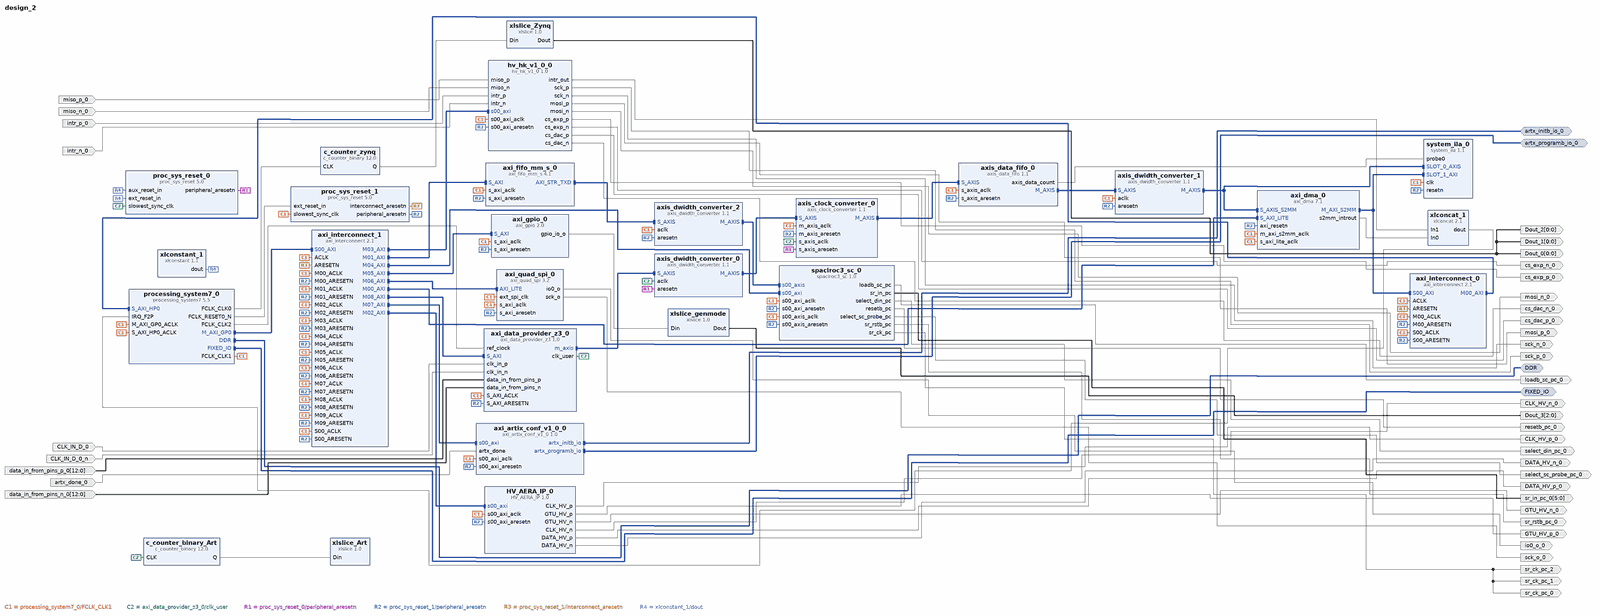
[diagram p0: block diagram of the top level, whole]
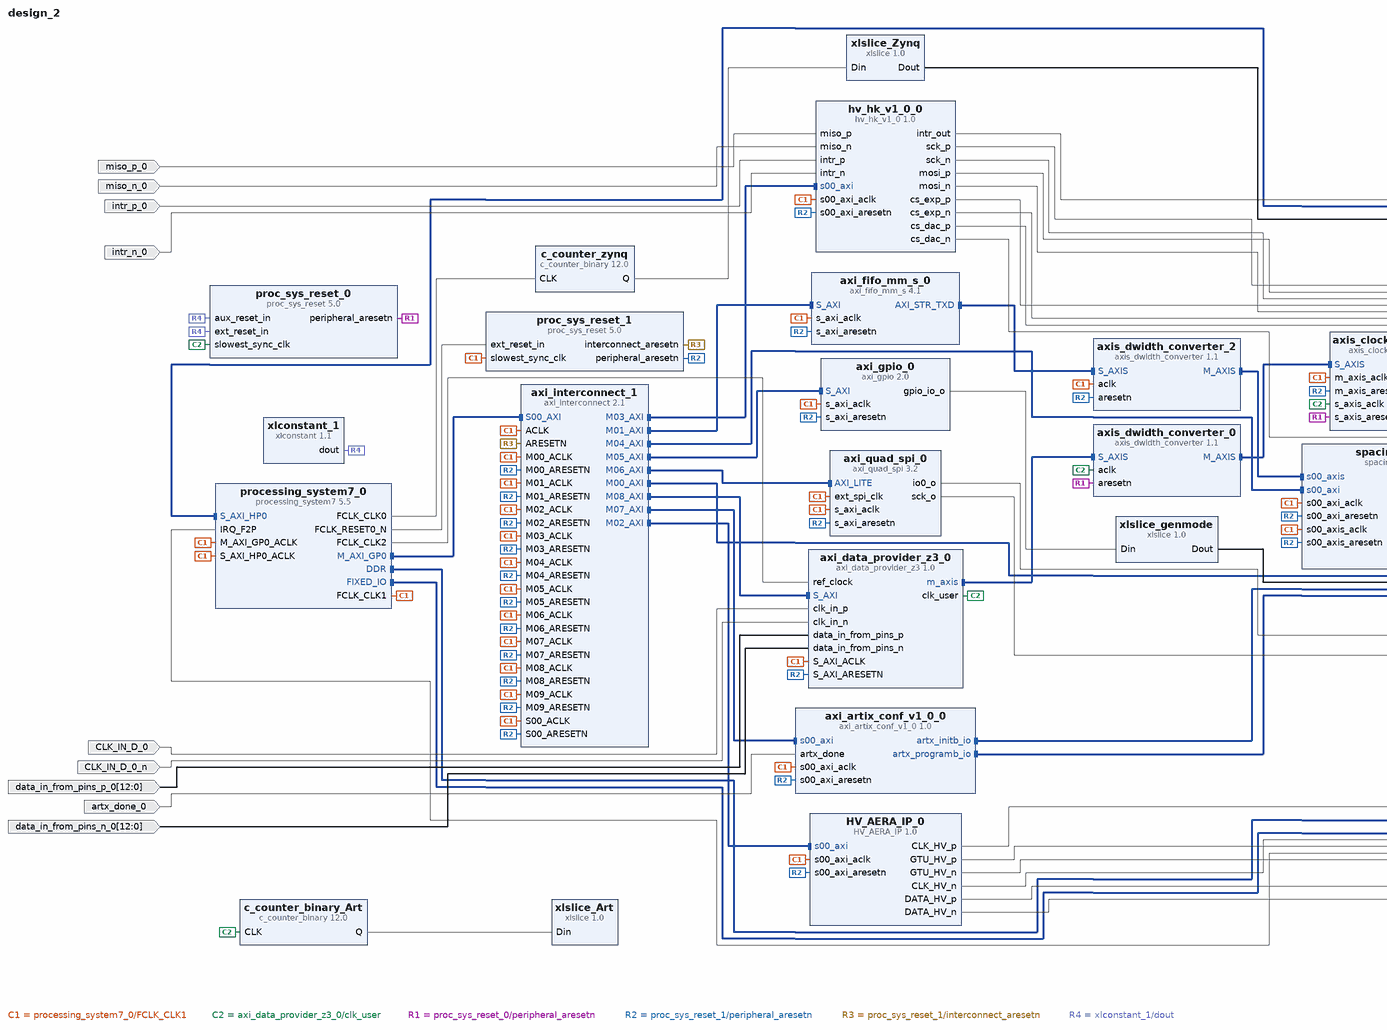
[diagram p1: block diagram of the top level, left part]
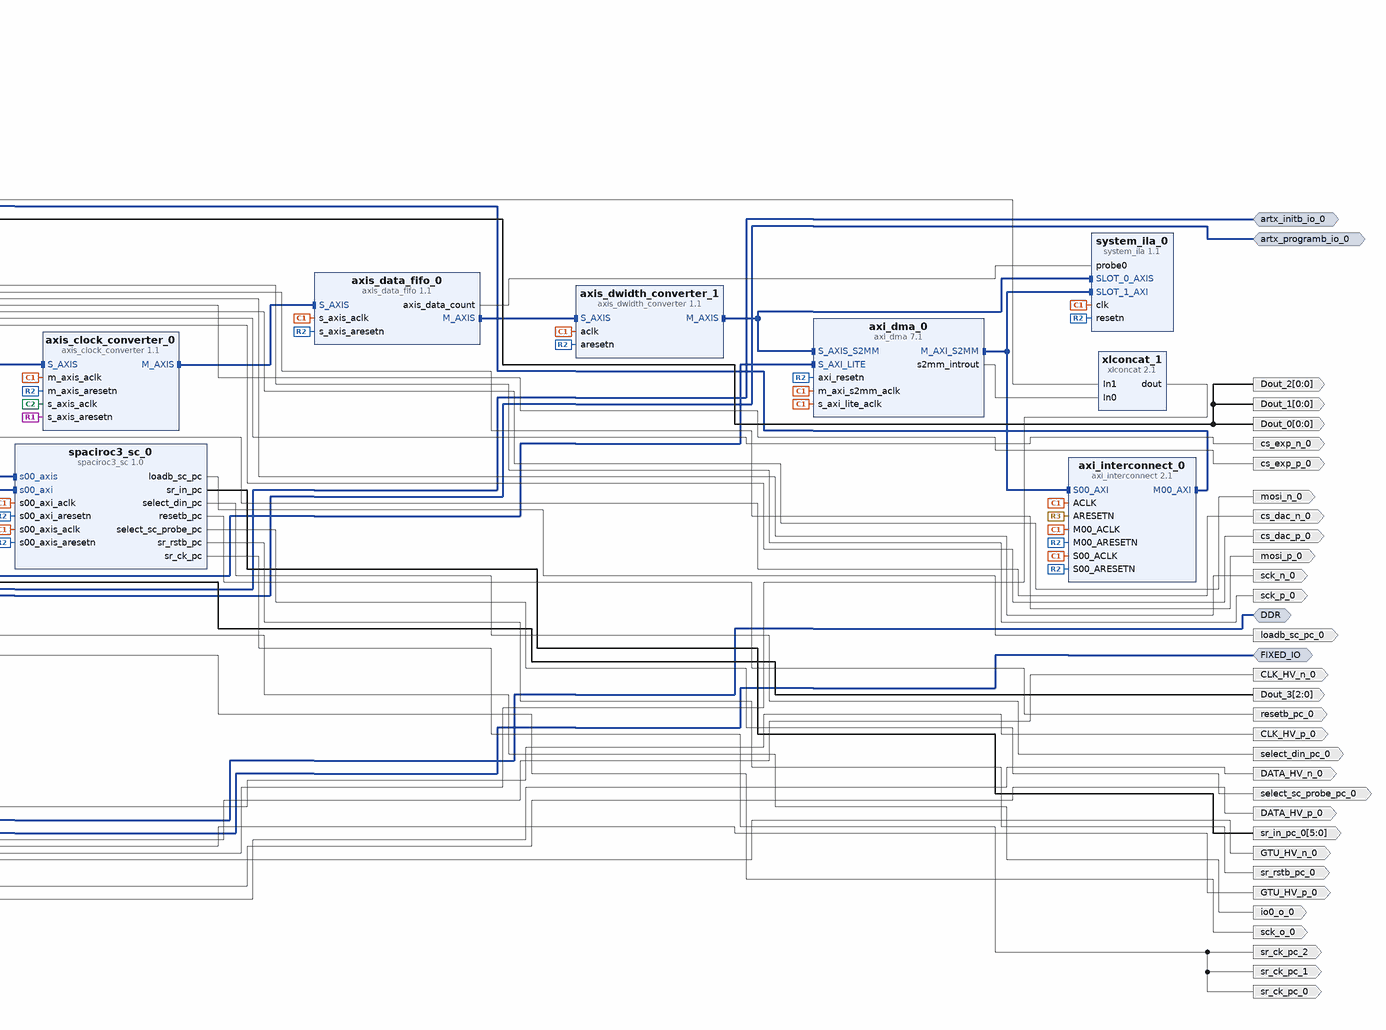
[diagram p2: block diagram of the top level, right part]
# Vivado block design design_2, xc7z035ffg676-2, Vivado 2018.1
create_bd_design design_2

create_bd_intf_port -mode Master -vlnv xilinx.com:interface:ddrx_rtl:1.0 DDR
create_bd_intf_port -mode Master -vlnv xilinx.com:display_processing_system7:fixedio_rtl:1.0 FIXED_IO
create_bd_intf_port -mode Master -vlnv xilinx.com:interface:gpio_rtl:1.0 artx_initb_io_0
create_bd_intf_port -mode Master -vlnv xilinx.com:interface:gpio_rtl:1.0 artx_programb_io_0
create_bd_intf_port -mode Slave -vlnv xilinx.com:interface:diff_clock_rtl:1.0 CLK_IN_D_0
create_bd_port -dir O -from 0 -to 0 Dout_2
create_bd_port -dir O -from 0 -to 0 Dout_1
create_bd_port -dir O -from 0 -to 0 Dout_0
create_bd_port -dir O sck_p_0
create_bd_port -dir O sck_n_0
create_bd_port -dir O mosi_p_0
create_bd_port -dir O mosi_n_0
create_bd_port -dir O cs_exp_p_0
create_bd_port -dir O cs_exp_n_0
create_bd_port -dir O cs_dac_p_0
create_bd_port -dir O cs_dac_n_0
create_bd_port -dir I miso_p_0
create_bd_port -dir I miso_n_0
create_bd_port -dir I intr_p_0
create_bd_port -dir I intr_n_0
create_bd_port -dir O -from 5 -to 0 sr_in_pc_0
create_bd_port -dir O loadb_sc_pc_0
create_bd_port -dir O select_din_pc_0
create_bd_port -dir O resetb_pc_0
create_bd_port -dir O select_sc_probe_pc_0
create_bd_port -dir O sr_rstb_pc_0
create_bd_port -dir O sr_ck_pc_1
create_bd_port -dir O sr_ck_pc_2
create_bd_port -dir O sr_ck_pc_0
create_bd_port -dir O GTU_HV_p_0
create_bd_port -dir O GTU_HV_n_0
create_bd_port -dir O CLK_HV_p_0
create_bd_port -dir O CLK_HV_n_0
create_bd_port -dir O DATA_HV_p_0
create_bd_port -dir O DATA_HV_n_0
create_bd_port -dir O -from 2 -to 0 Dout_3
create_bd_port -dir O io0_o_0
create_bd_port -dir O sck_o_0
create_bd_port -dir I artx_done_0
create_bd_port -dir I CLK_IN_D_0
create_bd_port -dir I CLK_IN_D_0_n
create_bd_port -dir I -from 12 -to 0 data_in_from_pins_p_0
create_bd_port -dir I -from 12 -to 0 data_in_from_pins_n_0

create_bd_cell -type ip -vlnv xilinx.com:ip:processing_system7:5.5 processing_system7_0
set_property -dict [list \
  CONFIG.PCW_FCLK_CLK1_BUF TRUE \
  CONFIG.PCW_FCLK_CLK2_BUF TRUE \
  CONFIG.PCW_UIPARAM_DDR_FREQ_MHZ 533.333333 \
  CONFIG.PCW_CPU_CPU_6X4X_MAX_RANGE 800 \
  CONFIG.PCW_APU_PERIPHERAL_FREQMHZ 800 \
  CONFIG.PCW_SDIO_PERIPHERAL_FREQMHZ 100 \
  CONFIG.PCW_UART_PERIPHERAL_FREQMHZ 100 \
  CONFIG.PCW_FPGA0_PERIPHERAL_FREQMHZ 200 \
  CONFIG.PCW_FPGA1_PERIPHERAL_FREQMHZ 100 \
  CONFIG.PCW_FPGA2_PERIPHERAL_FREQMHZ 200 \
  CONFIG.PCW_USE_S_AXI_HP0 1 \
  CONFIG.PCW_USE_FABRIC_INTERRUPT 1 \
  CONFIG.PCW_EN_CLK1_PORT 1 \
  CONFIG.PCW_EN_CLK2_PORT 1 \
  CONFIG.PCW_IRQ_F2P_INTR 1 \
  CONFIG.PCW_GP0_EN_MODIFIABLE_TXN 0 \
  CONFIG.PCW_GP1_EN_MODIFIABLE_TXN 0 \
  CONFIG.PCW_PERIPHERAL_BOARD_PRESET None \
  CONFIG.PCW_PRESET_BANK0_VOLTAGE {LVCMOS 1.8V} \
  CONFIG.PCW_PRESET_BANK1_VOLTAGE {LVCMOS 1.8V} \
  CONFIG.PCW_UIPARAM_DDR_PARTNO {MT41K256M16 RE-15E} \
  CONFIG.PCW_QSPI_PERIPHERAL_ENABLE 1 \
  CONFIG.PCW_QSPI_QSPI_IO {MIO 1 .. 6} \
  CONFIG.PCW_QSPI_GRP_SINGLE_SS_ENABLE 1 \
  CONFIG.PCW_QSPI_GRP_SINGLE_SS_IO {MIO 1 .. 6} \
  CONFIG.PCW_SINGLE_QSPI_DATA_MODE x4 \
  CONFIG.PCW_ENET0_PERIPHERAL_ENABLE 1 \
  CONFIG.PCW_ENET0_ENET0_IO {MIO 16 .. 27} \
  CONFIG.PCW_ENET0_GRP_MDIO_ENABLE 1 \
  CONFIG.PCW_ENET0_GRP_MDIO_IO {MIO 52 .. 53} \
  CONFIG.PCW_SD0_PERIPHERAL_ENABLE 1 \
  CONFIG.PCW_SD0_SD0_IO {MIO 40 .. 45} \
  CONFIG.PCW_SD0_GRP_CD_ENABLE 0 \
  CONFIG.PCW_SD0_GRP_WP_ENABLE 0 \
  CONFIG.PCW_SD1_PERIPHERAL_ENABLE 1 \
  CONFIG.PCW_SD1_SD1_IO {MIO 10 .. 15} \
  CONFIG.PCW_UART0_PERIPHERAL_ENABLE 1 \
  CONFIG.PCW_UART0_UART0_IO {MIO 50 .. 51} \
  CONFIG.PCW_UART1_PERIPHERAL_ENABLE 1 \
  CONFIG.PCW_UART1_UART1_IO {MIO 48 .. 49} \
  CONFIG.PCW_USB0_PERIPHERAL_ENABLE 1 \
  CONFIG.PCW_USB0_USB0_IO {MIO 28 .. 39} \
  CONFIG.PCW_GPIO_MIO_GPIO_ENABLE 0 \
  CONFIG.PCW_FPGA_FCLK1_ENABLE 1 \
  CONFIG.PCW_FPGA_FCLK2_ENABLE 1 \
] [get_bd_cells processing_system7_0]
# 494 more settings of processing_system7_0 are not shown: defaults, MIO pin electricals, DDR timing, and values the tool derives
create_bd_cell -type ip -vlnv xilinx.com:ip:c_counter_binary:12.0 c_counter_zynq
create_bd_cell -type ip -vlnv xilinx.com:ip:xlslice:1.0 xlslice_Zynq
set_property -dict {CONFIG.DIN_TO 0 CONFIG.DIN_FROM 0 CONFIG.DIN_WIDTH 16} [get_bd_cells xlslice_Zynq]
create_bd_cell -type ip -vlnv xilinx.com:ip:axis_dwidth_converter:1.1 axis_dwidth_converter_0
set_property -dict {CONFIG.M_TDATA_NUM_BYTES 1 CONFIG.HAS_TLAST 1 CONFIG.HAS_MI_TKEEP 0} [get_bd_cells axis_dwidth_converter_0]
create_bd_cell -type ip -vlnv xilinx.com:ip:axis_data_fifo:1.1 axis_data_fifo_0
set_property -dict {CONFIG.FIFO_DEPTH 4096 CONFIG.FIFO_MODE 2} [get_bd_cells axis_data_fifo_0]
create_bd_cell -type ip -vlnv xilinx.com:ip:axis_clock_converter:1.1 axis_clock_converter_0
create_bd_cell -type ip -vlnv xilinx.com:ip:proc_sys_reset:5.0 proc_sys_reset_1
create_bd_cell -type ip -vlnv xilinx.com:ip:axi_dma:7.1 axi_dma_0
set_property -dict [list \
  CONFIG.c_include_sg 0 \
  CONFIG.c_sg_length_width 16 \
  CONFIG.c_include_mm2s 0 \
  CONFIG.c_include_s2mm 1 \
] [get_bd_cells axi_dma_0]
create_bd_cell -type ip -vlnv xilinx.com:ip:axi_interconnect:2.1 axi_interconnect_0
set_property -dict {CONFIG.NUM_MI 1} [get_bd_cells axi_interconnect_0]
create_bd_cell -type ip -vlnv xilinx.com:ip:axi_interconnect:2.1 axi_interconnect_1
set_property -dict {CONFIG.NUM_MI 10} [get_bd_cells axi_interconnect_1]
create_bd_cell -type ip -vlnv xilinx.com:ip:axis_dwidth_converter:1.1 axis_dwidth_converter_1
set_property -dict {CONFIG.M_TDATA_NUM_BYTES 8} [get_bd_cells axis_dwidth_converter_1]
create_bd_cell -type ip -vlnv xilinx.com:ip:xlconstant:1.1 xlconstant_1
create_bd_cell -type ip -vlnv xilinx.com:ip:proc_sys_reset:5.0 proc_sys_reset_0
create_bd_cell -type ip -vlnv xilinx.com:ip:c_counter_binary:12.0 c_counter_binary_Art
create_bd_cell -type ip -vlnv xilinx.com:ip:xlslice:1.0 xlslice_Art
set_property -dict {CONFIG.DIN_TO 4 CONFIG.DIN_FROM 4 CONFIG.DIN_WIDTH 16 CONFIG.DOUT_WIDTH 1} [get_bd_cells xlslice_Art]
create_bd_cell -type ip -vlnv xilinx.com:ip:system_ila:1.1 system_ila_0
set_property -dict [list \
  CONFIG.C_SLOT 0 \
  CONFIG.C_SLOT_0_APC_EN 0 \
  CONFIG.C_SLOT_1_APC_EN 0 \
  CONFIG.C_SLOT_1_AXI_AW_SEL_DATA 1 \
  CONFIG.C_SLOT_1_AXI_W_SEL_DATA 1 \
  CONFIG.C_SLOT_1_AXI_B_SEL_DATA 1 \
  CONFIG.C_SLOT_1_AXI_AR_SEL_DATA 1 \
  CONFIG.C_SLOT_1_AXI_R_SEL_DATA 1 \
  CONFIG.C_SLOT_1_AXI_AW_SEL_TRIG 1 \
  CONFIG.C_SLOT_1_AXI_W_SEL_TRIG 1 \
  CONFIG.C_SLOT_1_AXI_B_SEL_TRIG 1 \
  CONFIG.C_SLOT_1_AXI_AR_SEL_TRIG 1 \
  CONFIG.C_SLOT_1_AXI_R_SEL_TRIG 1 \
  CONFIG.C_SLOT_0_AXI_DATA_SEL 1 \
  CONFIG.C_SLOT_0_AXI_TRIG_SEL 1 \
  CONFIG.C_PROBE0_TYPE 0 \
  CONFIG.C_NUM_OF_PROBES 1 \
  CONFIG.C_NUM_MONITOR_SLOTS 2 \
  CONFIG.C_SLOT_0_INTF_TYPE xilinx.com:interface:axis_rtl:1.0 \
  CONFIG.C_SLOT_1_INTF_TYPE xilinx.com:interface:aximm_rtl:1.0 \
  CONFIG.C_MON_TYPE MIX \
] [get_bd_cells system_ila_0]
create_bd_cell -type ip -vlnv user.org:user:HV_AERA_IP:1.0 HV_AERA_IP_0
create_bd_cell -type ip -vlnv user.org:user:hv_hk_v1_0:1.0 hv_hk_v1_0_0
create_bd_cell -type ip -vlnv user.org:user:spaciroc3_sc:1.0 spaciroc3_sc_0
create_bd_cell -type ip -vlnv xilinx.com:ip:axis_dwidth_converter:1.1 axis_dwidth_converter_2
set_property -dict {CONFIG.S_TDATA_NUM_BYTES 4 CONFIG.M_TDATA_NUM_BYTES 24} [get_bd_cells axis_dwidth_converter_2]
create_bd_cell -type ip -vlnv xilinx.com:ip:axi_fifo_mm_s:4.1 axi_fifo_mm_s_0
set_property -dict [list \
  CONFIG.C_TX_FIFO_PE_THRESHOLD 2 \
  CONFIG.C_TX_FIFO_PF_THRESHOLD 4091 \
  CONFIG.C_TX_FIFO_DEPTH 4096 \
  CONFIG.C_USE_TX_DATA 1 \
  CONFIG.C_USE_RX_DATA 0 \
  CONFIG.C_USE_TX_CTRL 0 \
] [get_bd_cells axi_fifo_mm_s_0]
create_bd_cell -type ip -vlnv xilinx.com:ip:xlconcat:2.1 xlconcat_1
create_bd_cell -type ip -vlnv xilinx.com:ip:axi_gpio:2.0 axi_gpio_0
set_property -dict {CONFIG.C_ALL_OUTPUTS 1} [get_bd_cells axi_gpio_0]
create_bd_cell -type ip -vlnv xilinx.com:ip:xlslice:1.0 xlslice_genmode
set_property -dict {CONFIG.DIN_FROM 2 CONFIG.DOUT_WIDTH 3} [get_bd_cells xlslice_genmode]
create_bd_cell -type ip -vlnv xilinx.com:ip:axi_quad_spi:3.2 axi_quad_spi_0
set_property -dict {CONFIG.C_USE_STARTUP 0 CONFIG.C_FIFO_DEPTH 256} [get_bd_cells axi_quad_spi_0]
create_bd_cell -type ip -vlnv xilinx.com:user:axi_artix_conf_v1_0:1.0 axi_artix_conf_v1_0_0
create_bd_cell -type ip -vlnv user.org:user:axi_data_provider_z3:1.0 axi_data_provider_z3_0

# ---- connections ----

connect_bd_intf_net [get_bd_intf_pins axis_dwidth_converter_0/M_AXIS] [get_bd_intf_pins axis_clock_converter_0/S_AXIS]
connect_bd_intf_net [get_bd_intf_pins axis_clock_converter_0/M_AXIS] [get_bd_intf_pins axis_data_fifo_0/S_AXIS]
connect_bd_intf_net [get_bd_intf_pins axi_interconnect_0/M00_AXI] [get_bd_intf_pins processing_system7_0/S_AXI_HP0]
connect_bd_intf_net [get_bd_intf_pins axi_interconnect_1/S00_AXI] [get_bd_intf_pins processing_system7_0/M_AXI_GP0]
connect_bd_intf_net [get_bd_intf_pins axi_interconnect_1/M00_AXI] [get_bd_intf_pins axi_dma_0/S_AXI_LITE]
connect_bd_intf_net [get_bd_intf_pins axis_data_fifo_0/M_AXIS] [get_bd_intf_pins axis_dwidth_converter_1/S_AXIS]
connect_bd_intf_net [get_bd_intf_pins axis_dwidth_converter_1/M_AXIS] [get_bd_intf_pins axi_dma_0/S_AXIS_S2MM]
connect_bd_intf_net [get_bd_intf_pins axis_dwidth_converter_1/M_AXIS] [get_bd_intf_pins system_ila_0/SLOT_0_AXIS]
connect_bd_intf_net [get_bd_intf_pins axi_interconnect_0/S00_AXI] [get_bd_intf_pins axi_dma_0/M_AXI_S2MM]
connect_bd_intf_net [get_bd_intf_pins axi_interconnect_0/S00_AXI] [get_bd_intf_pins system_ila_0/SLOT_1_AXI]
connect_bd_intf_net [get_bd_intf_pins axi_fifo_mm_s_0/AXI_STR_TXD] [get_bd_intf_pins axis_dwidth_converter_2/S_AXIS]
connect_bd_intf_net [get_bd_intf_pins axis_dwidth_converter_2/M_AXIS] [get_bd_intf_pins spaciroc3_sc_0/s00_axis]
connect_bd_intf_net [get_bd_intf_pins axi_interconnect_1/M01_AXI] [get_bd_intf_pins axi_fifo_mm_s_0/S_AXI]
connect_bd_intf_net [get_bd_intf_pins axi_interconnect_1/M02_AXI] [get_bd_intf_pins HV_AERA_IP_0/s00_axi]
connect_bd_intf_net [get_bd_intf_pins axi_interconnect_1/M03_AXI] [get_bd_intf_pins hv_hk_v1_0_0/s00_axi]
connect_bd_intf_net [get_bd_intf_pins spaciroc3_sc_0/s00_axi] [get_bd_intf_pins axi_interconnect_1/M04_AXI]
connect_bd_intf_net [get_bd_intf_pins axi_interconnect_1/M05_AXI] [get_bd_intf_pins axi_gpio_0/S_AXI]
connect_bd_intf_net [get_bd_intf_pins axi_interconnect_1/M06_AXI] [get_bd_intf_pins axi_quad_spi_0/AXI_LITE]
connect_bd_intf_net [get_bd_intf_pins axi_interconnect_1/M07_AXI] [get_bd_intf_pins axi_artix_conf_v1_0_0/s00_axi]
connect_bd_intf_net [get_bd_intf_pins axi_data_provider_z3_0/S_AXI] [get_bd_intf_pins axi_interconnect_1/M08_AXI]
connect_bd_intf_net [get_bd_intf_pins axis_dwidth_converter_0/S_AXIS] [get_bd_intf_pins axi_data_provider_z3_0/m_axis]
connect_bd_intf_net [get_bd_intf_ports DDR] [get_bd_intf_pins processing_system7_0/DDR]
connect_bd_intf_net [get_bd_intf_ports FIXED_IO] [get_bd_intf_pins processing_system7_0/FIXED_IO]
connect_bd_intf_net [get_bd_intf_ports artx_initb_io_0] [get_bd_intf_pins axi_artix_conf_v1_0_0/artx_initb_io]
connect_bd_intf_net [get_bd_intf_ports artx_programb_io_0] [get_bd_intf_pins axi_artix_conf_v1_0_0/artx_programb_io]
connect_bd_net [get_bd_pins processing_system7_0/FCLK_CLK0] [get_bd_pins c_counter_zynq/CLK]
connect_bd_net -net c_counter_binary_0_Q [get_bd_pins c_counter_zynq/Q] [get_bd_pins xlslice_Zynq/Din]
connect_bd_net [get_bd_pins xlslice_Zynq/Dout] [get_bd_ports Dout_0] [get_bd_ports Dout_1] [get_bd_ports Dout_2]
connect_bd_net [get_bd_pins processing_system7_0/FCLK_CLK1] \
  [get_bd_pins axis_data_fifo_0/s_axis_aclk] [get_bd_pins proc_sys_reset_1/slowest_sync_clk] \
  [get_bd_pins axis_clock_converter_0/m_axis_aclk] [get_bd_pins axi_dma_0/s_axi_lite_aclk] \
  [get_bd_pins axi_dma_0/m_axi_s2mm_aclk] [get_bd_pins processing_system7_0/M_AXI_GP0_ACLK] \
  [get_bd_pins processing_system7_0/S_AXI_HP0_ACLK] [get_bd_pins axis_dwidth_converter_1/aclk] [get_bd_pins system_ila_0/clk] \
  [get_bd_pins HV_AERA_IP_0/s00_axi_aclk] [get_bd_pins spaciroc3_sc_0/s00_axi_aclk] \
  [get_bd_pins spaciroc3_sc_0/s00_axis_aclk] [get_bd_pins hv_hk_v1_0_0/s00_axi_aclk] \
  [get_bd_pins axis_dwidth_converter_2/aclk] [get_bd_pins axi_fifo_mm_s_0/s_axi_aclk] [get_bd_pins axi_gpio_0/s_axi_aclk] \
  [get_bd_pins axi_quad_spi_0/s_axi_aclk] [get_bd_pins axi_artix_conf_v1_0_0/s00_axi_aclk] \
  [get_bd_pins axi_quad_spi_0/ext_spi_clk] [get_bd_pins axi_data_provider_z3_0/S_AXI_ACLK] \
  [get_bd_pins axi_interconnect_0/ACLK] [get_bd_pins axi_interconnect_0/S00_ACLK] [get_bd_pins axi_interconnect_0/M00_ACLK] \
  [get_bd_pins axi_interconnect_1/ACLK] [get_bd_pins axi_interconnect_1/S00_ACLK] [get_bd_pins axi_interconnect_1/M00_ACLK] \
  [get_bd_pins axi_interconnect_1/M01_ACLK] [get_bd_pins axi_interconnect_1/M02_ACLK] \
  [get_bd_pins axi_interconnect_1/M03_ACLK] [get_bd_pins axi_interconnect_1/M04_ACLK] \
  [get_bd_pins axi_interconnect_1/M05_ACLK] [get_bd_pins axi_interconnect_1/M06_ACLK] \
  [get_bd_pins axi_interconnect_1/M07_ACLK] [get_bd_pins axi_interconnect_1/M08_ACLK] \
  [get_bd_pins axi_interconnect_1/M09_ACLK]
connect_bd_net -net util_ds_buf_0_BUFG_O [get_bd_pins axi_data_provider_z3_0/clk_user] \
  [get_bd_pins axis_dwidth_converter_0/aclk] [get_bd_pins axis_clock_converter_0/s_axis_aclk] \
  [get_bd_pins proc_sys_reset_0/slowest_sync_clk] [get_bd_pins c_counter_binary_Art/CLK]
connect_bd_net [get_bd_pins proc_sys_reset_0/peripheral_aresetn] \
  [get_bd_pins axis_dwidth_converter_0/aresetn] [get_bd_pins axis_clock_converter_0/s_axis_aresetn]
connect_bd_net [get_bd_pins processing_system7_0/FCLK_RESET0_N] [get_bd_pins proc_sys_reset_1/ext_reset_in]
connect_bd_net [get_bd_pins proc_sys_reset_1/peripheral_aresetn] \
  [get_bd_pins axis_data_fifo_0/s_axis_aresetn] [get_bd_pins axis_clock_converter_0/m_axis_aresetn] \
  [get_bd_pins axi_dma_0/axi_resetn] [get_bd_pins axis_dwidth_converter_1/aresetn] [get_bd_pins system_ila_0/resetn] \
  [get_bd_pins HV_AERA_IP_0/s00_axi_aresetn] [get_bd_pins spaciroc3_sc_0/s00_axi_aresetn] \
  [get_bd_pins spaciroc3_sc_0/s00_axis_aresetn] [get_bd_pins hv_hk_v1_0_0/s00_axi_aresetn] \
  [get_bd_pins axis_dwidth_converter_2/aresetn] [get_bd_pins axi_fifo_mm_s_0/s_axi_aresetn] \
  [get_bd_pins axi_gpio_0/s_axi_aresetn] [get_bd_pins axi_quad_spi_0/s_axi_aresetn] \
  [get_bd_pins axi_artix_conf_v1_0_0/s00_axi_aresetn] [get_bd_pins axi_data_provider_z3_0/S_AXI_ARESETN] \
  [get_bd_pins axi_interconnect_0/S00_ARESETN] [get_bd_pins axi_interconnect_0/M00_ARESETN] \
  [get_bd_pins axi_interconnect_1/S00_ARESETN] [get_bd_pins axi_interconnect_1/M00_ARESETN] \
  [get_bd_pins axi_interconnect_1/M01_ARESETN] [get_bd_pins axi_interconnect_1/M02_ARESETN] \
  [get_bd_pins axi_interconnect_1/M03_ARESETN] [get_bd_pins axi_interconnect_1/M04_ARESETN] \
  [get_bd_pins axi_interconnect_1/M05_ARESETN] [get_bd_pins axi_interconnect_1/M06_ARESETN] \
  [get_bd_pins axi_interconnect_1/M07_ARESETN] [get_bd_pins axi_interconnect_1/M08_ARESETN] \
  [get_bd_pins axi_interconnect_1/M09_ARESETN]
connect_bd_net -net ARESETN_1 [get_bd_pins proc_sys_reset_1/interconnect_aresetn] \
  [get_bd_pins axi_interconnect_0/ARESETN] [get_bd_pins axi_interconnect_1/ARESETN]
connect_bd_net [get_bd_pins xlconstant_1/dout] [get_bd_pins proc_sys_reset_0/ext_reset_in] [get_bd_pins proc_sys_reset_0/aux_reset_in]
connect_bd_net [get_bd_pins c_counter_binary_Art/Q] [get_bd_pins xlslice_Art/Din]
connect_bd_net [get_bd_pins processing_system7_0/FCLK_CLK2] [get_bd_pins axi_data_provider_z3_0/ref_clock]
connect_bd_net [get_bd_pins axis_data_fifo_0/axis_data_count] [get_bd_pins system_ila_0/probe0]
connect_bd_net [get_bd_pins xlconcat_1/dout] [get_bd_pins processing_system7_0/IRQ_F2P]
connect_bd_net [get_bd_pins axi_dma_0/s2mm_introut] [get_bd_pins xlconcat_1/In0]
connect_bd_net [get_bd_pins hv_hk_v1_0_0/intr_out] [get_bd_pins xlconcat_1/In1]
connect_bd_net [get_bd_pins hv_hk_v1_0_0/sck_p] [get_bd_ports sck_p_0]
connect_bd_net [get_bd_pins hv_hk_v1_0_0/sck_n] [get_bd_ports sck_n_0]
connect_bd_net [get_bd_pins hv_hk_v1_0_0/mosi_p] [get_bd_ports mosi_p_0]
connect_bd_net [get_bd_pins hv_hk_v1_0_0/mosi_n] [get_bd_ports mosi_n_0]
connect_bd_net [get_bd_pins hv_hk_v1_0_0/cs_exp_p] [get_bd_ports cs_exp_p_0]
connect_bd_net [get_bd_pins hv_hk_v1_0_0/cs_exp_n] [get_bd_ports cs_exp_n_0]
connect_bd_net [get_bd_pins hv_hk_v1_0_0/cs_dac_p] [get_bd_ports cs_dac_p_0]
connect_bd_net [get_bd_pins hv_hk_v1_0_0/cs_dac_n] [get_bd_ports cs_dac_n_0]
connect_bd_net -net miso_p_0_1 [get_bd_ports miso_p_0] [get_bd_pins hv_hk_v1_0_0/miso_p]
connect_bd_net -net miso_n_0_1 [get_bd_ports miso_n_0] [get_bd_pins hv_hk_v1_0_0/miso_n]
connect_bd_net -net intr_p_0_1 [get_bd_ports intr_p_0] [get_bd_pins hv_hk_v1_0_0/intr_p]
connect_bd_net -net intr_n_0_1 [get_bd_ports intr_n_0] [get_bd_pins hv_hk_v1_0_0/intr_n]
connect_bd_net [get_bd_pins spaciroc3_sc_0/sr_in_pc] [get_bd_ports sr_in_pc_0]
connect_bd_net [get_bd_pins spaciroc3_sc_0/loadb_sc_pc] [get_bd_ports loadb_sc_pc_0]
connect_bd_net [get_bd_pins spaciroc3_sc_0/select_din_pc] [get_bd_ports select_din_pc_0]
connect_bd_net [get_bd_pins spaciroc3_sc_0/resetb_pc] [get_bd_ports resetb_pc_0]
connect_bd_net [get_bd_pins spaciroc3_sc_0/select_sc_probe_pc] [get_bd_ports select_sc_probe_pc_0]
connect_bd_net [get_bd_pins spaciroc3_sc_0/sr_rstb_pc] [get_bd_ports sr_rstb_pc_0]
connect_bd_net [get_bd_pins spaciroc3_sc_0/sr_ck_pc] [get_bd_ports sr_ck_pc_0] [get_bd_ports sr_ck_pc_2] [get_bd_ports sr_ck_pc_1]
connect_bd_net [get_bd_pins HV_AERA_IP_0/GTU_HV_p] [get_bd_ports GTU_HV_p_0]
connect_bd_net [get_bd_pins HV_AERA_IP_0/GTU_HV_n] [get_bd_ports GTU_HV_n_0]
connect_bd_net [get_bd_pins HV_AERA_IP_0/CLK_HV_p] [get_bd_ports CLK_HV_p_0]
connect_bd_net [get_bd_pins HV_AERA_IP_0/CLK_HV_n] [get_bd_ports CLK_HV_n_0]
connect_bd_net [get_bd_pins HV_AERA_IP_0/DATA_HV_p] [get_bd_ports DATA_HV_p_0]
connect_bd_net [get_bd_pins HV_AERA_IP_0/DATA_HV_n] [get_bd_ports DATA_HV_n_0]
connect_bd_net [get_bd_pins axi_gpio_0/gpio_io_o] [get_bd_pins xlslice_genmode/Din]
connect_bd_net -net xlslice_0_Dout [get_bd_pins xlslice_genmode/Dout] [get_bd_ports Dout_3]
connect_bd_net [get_bd_pins axi_quad_spi_0/io0_o] [get_bd_ports io0_o_0]
connect_bd_net [get_bd_pins axi_quad_spi_0/sck_o] [get_bd_ports sck_o_0]
connect_bd_net -net artx_done_0_1 [get_bd_ports artx_done_0] [get_bd_pins axi_artix_conf_v1_0_0/artx_done]
connect_bd_net -net clk_in_p_0_1 [get_bd_ports CLK_IN_D_0] [get_bd_pins axi_data_provider_z3_0/clk_in_p]
connect_bd_net -net clk_in_n_0_1 [get_bd_ports CLK_IN_D_0_n] [get_bd_pins axi_data_provider_z3_0/clk_in_n]
connect_bd_net -net data_in_from_pins_p_0_1 [get_bd_ports data_in_from_pins_p_0] [get_bd_pins axi_data_provider_z3_0/data_in_from_pins_p]
connect_bd_net -net data_in_from_pins_n_0_1 [get_bd_ports data_in_from_pins_n_0] [get_bd_pins axi_data_provider_z3_0/data_in_from_pins_n]

# ---- address map ----
assign_bd_address -offset 0x00000000 -range 1G -target_address_space [get_bd_addr_spaces axi_dma_0/Data_S2MM] [get_bd_addr_segs processing_system7_0/S_AXI_HP0/HP0_DDR_LOWOCM]
assign_bd_address -offset 0x40400000 -range 64K -target_address_space [get_bd_addr_spaces processing_system7_0/Data] [get_bd_addr_segs axi_dma_0/S_AXI_LITE/Reg]
assign_bd_address -offset 0x41200000 -range 64K -target_address_space [get_bd_addr_spaces processing_system7_0/Data] [get_bd_addr_segs axi_gpio_0/S_AXI/Reg]
assign_bd_address -offset 0x41E00000 -range 64K -target_address_space [get_bd_addr_spaces processing_system7_0/Data] [get_bd_addr_segs axi_quad_spi_0/AXI_LITE/Reg]
assign_bd_address -offset 0x43C00000 -range 64K -target_address_space [get_bd_addr_spaces processing_system7_0/Data] [get_bd_addr_segs HV_AERA_IP_0/s00_axi/reg0]
assign_bd_address -offset 0x43C10000 -range 64K -target_address_space [get_bd_addr_spaces processing_system7_0/Data] [get_bd_addr_segs axi_fifo_mm_s_0/S_AXI/Mem0]
assign_bd_address -offset 0x43C20000 -range 64K -target_address_space [get_bd_addr_spaces processing_system7_0/Data] [get_bd_addr_segs hv_hk_v1_0_0/s00_axi/reg0]
assign_bd_address -offset 0x43C30000 -range 64K -target_address_space [get_bd_addr_spaces processing_system7_0/Data] [get_bd_addr_segs spaciroc3_sc_0/s00_axi/reg0]
assign_bd_address -offset 0x43C40000 -range 64K -target_address_space [get_bd_addr_spaces processing_system7_0/Data] [get_bd_addr_segs axi_artix_conf_v1_0_0/s00_axi/reg0]

validate_bd_design
save_bd_design
